# EAGLE design LDConnector v3 - CXY1 (EAGLE 7.7.0)
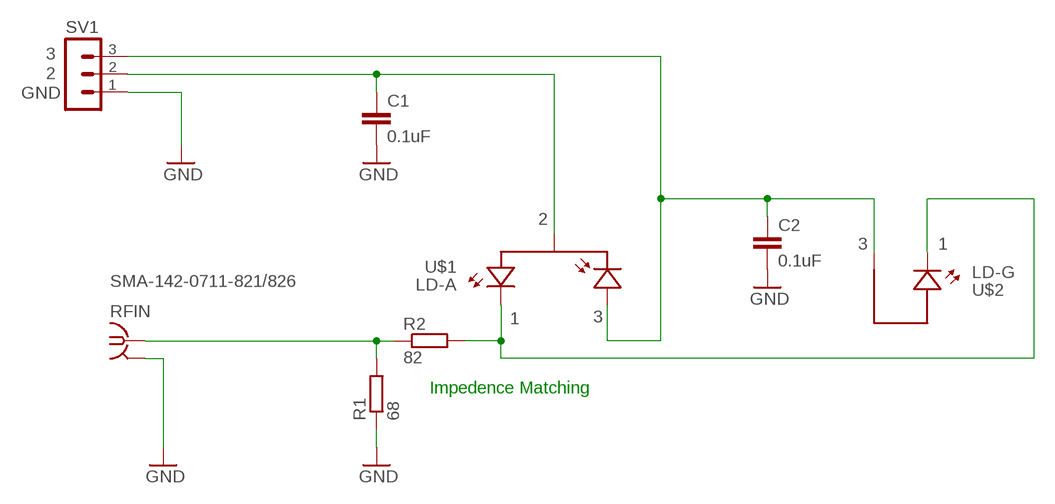
[diagram p0: schematic, sheet 1]

## Parts
C1  0.1uF  C-EUC0603  [C0603]
C2  0.1uF  C-EUC0603  [C0603]
R1  68  R-EU_R0603  [R0603]
R2  82  R-EU_R0603  [R0603]
RFIN  SMA-142-0711-821/826  [J502-ND-142-0711-821/826]
SV1  MA03-1  [MA03-1]
U$1  LD-A  [TYPEA]
U$2  LD-G  [TYPEG]

## Nets
GND: C1.2 C2.2 R1.1 RFIN.G@1 RFIN.G@2 RFIN.G@3 RFIN.G@4 SV1.1
N$1: C1.1 SV1.2 U$1.2-PDC-LDA(LDA-PDC)
N$2: R2.2 U$1.1-LDC(LDC) U$2.1-LDC(LDC)
N$3: R1.2 R2.1 RFIN.1
N$6: C2.1 SV1.3 U$1.3-PDA(PDA) U$2.3-LDA(LDA)

## Notes on the sheet
- 3
- 2
- GND
- 2
- 3 | 1
- 1 | 3
- Impedence Matching

## Library data of the parts
C1 C2 = rcl:C-EU: CAPACITOR, European symbol
R1 R2 = rcl:R-EU_: RESISTOR, European symbol
RFIN = con-coax:SMA-: SMA 50 Ohm End Launch Jack Receptacle - Round Contact Johnson Components Source: www.johnsoncomponents.com .. J502-ND.pdf; MF: JOHNSON COMPONENTS; MPN: 142-0711-821; OC_FARNELL: 1019328; OC_NEWARK: 16F3627
SV1 = con-lstb:MA03-1: PIN HEADER; OC_FARNELL: unknown; OC_NEWARK: unknown
U$1 = laser diode:LD-A
U$2 = laser diode:LD-G

## Board
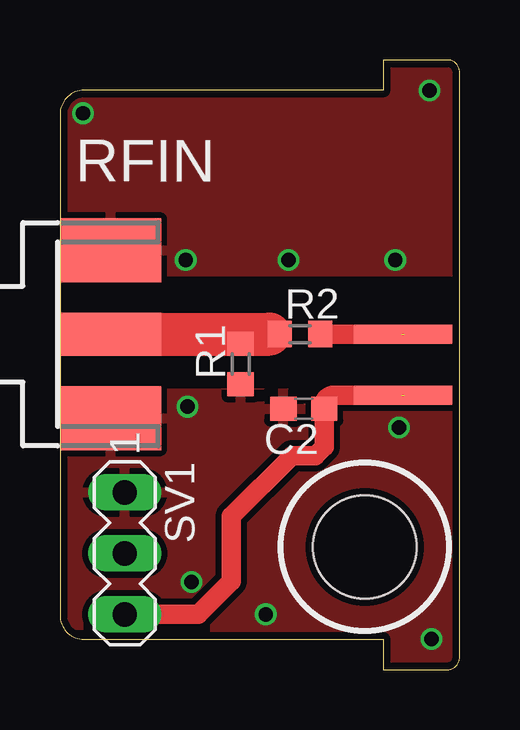
[diagram p1: board, top side]
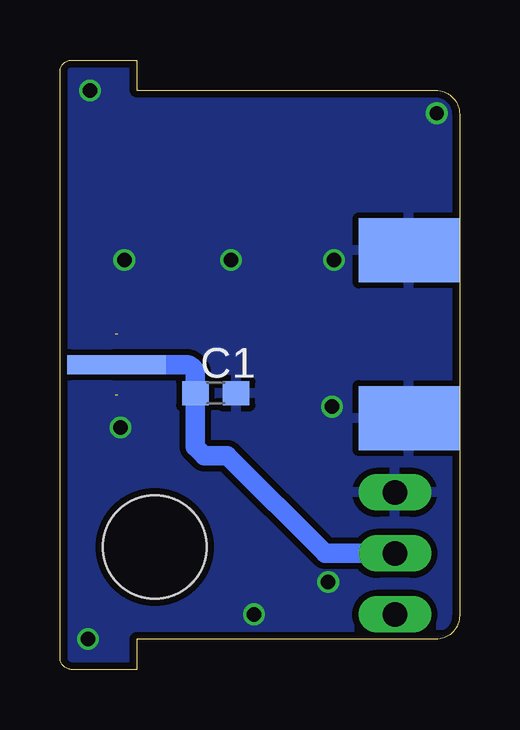
[diagram p2: board, bottom side, seen from below]

Size 16.65 x 25.4 mm. Coordinates in mm from the lower left corner, seen from the top.
Outline: 13.46,24.14 1,24.14 arc90 0,23.14 0,2.26 arc90 1,1.26 13.46,1.26 13.46,0 16.15,0 arc90 16.65,0.5 16.65,24.9 arc90 16.15,25.4 13.46,25.4 13.46,24.14
Copper layers (1*16): Top 0.035mm / dielectric 1.6mm / Bottom 0.035mm
Design rules "Elecrow_2-layer_PCB_eagle_rule *": minimum track width 6mil, minimum drill 12mil, track to track 10mil, track to pad 10mil, pad to pad 10mil, via to via 10mil, smd to smd 0mil, copper to edge 0.3mm, drill to drill 10mil, minimum pad ring 6mil, minimum via ring 6mil, stop-mask expansion 0mil, vias tented up to drill 100mil, thermal gap 10mil
Holes 4.3 mm at 12.7,5.11

### Footprints (pad centres in the part's own frame; a part is rotated, then mirrored left to right if it is on the bottom)
C0603 = smd 1.1 x 1: 1 -0.85,0; 2 0.85,0
R0603 = smd 1 x 1.1: 1 -0.85,0; 2 0.85,0
J502-ND-142-0711-821/826 = smd 4.191 x 1.778: 1 2.115,0 | smd 4.191 x 2.667: G@1 2.115,3.495; G@2 2.115,-3.495 | smd 4.191 x 2.667 bottom: G@3 2.115,3.495; G@4 2.115,-3.495
MA03-1 = drill 1.016 long: 1 -2.54,0; 2 0,0; 3 2.54,0
TYPEA = smd 4 x 0.8: 1-LDC -2.435,-1.27; 3-PDA -2.435,1.27 | smd 4 x 0.8 bottom: 2-PDC-LDA -2.435,0
TYPEG = smd 4 x 0.8: 1-LDC -2.435,1.27; 3-LDA -2.435,-1.27 | smd 4 x 0.8 bottom: 2-NC -2.435,0

### Placement (x,y rotation side)
C1  10.16,11.51 0 bottom
C2  10.16,10.88 180 top
R1  7.53,12.73 90 top
R2  10,13.98 0 top
RFIN  0,13.98 0 top
SV1  2.7,4.84 270 top
U$1  11.91,12.7 180 top
U$2  16.67,12.7 0 top

### Tracks (layer width: path | path; a pad name or v marks a point on that pad's centre or on a via)
GND  (via drill 0.6)
  other vias: 14.13,10.08 8.57,2.3 13.97,17.07 5.24,17.07 15.4,24.13 15.48,1.27 9.53,17.07 5.32,10.96 0.95,23.18 5.48,3.65
  pour Bottom: -1.27,25.64 17.78,25.64 17.78,-1.03 0,-1.03
  pour Top: 0.16,11.51 16.99,11.51 17.14,-1.03 0.16,-1.03
  pour Top: 16.51,25.64 -0.08,25.64 -0.08,16.59 16.51,16.59
N$1
  Bottom 0.813: U$1.2-PDC-LDA 11.42,12.7 arc45 11.11,12.57 arc45 11.01,12.32 C1.1 11.01,9.29 10.64,8.92 9.68,8.92 5.61,4.84 SV1.2
N$2  (1 unrouted)
  Top 0.813: U$2.1-LDC 10.93,13.97 R2.2
N$3
  Top 1.016: 6.97,14.05 RFIN.1 | R1.2 6.97,14.05 | 6.97,14.05 R2.1
N$4
  Top 1.8: 3.33,13.98 8.73,13.98
N$6  (1 unrouted)
  Top 0.813: U$2.3-LDA 11.42,11.43 arc45 11.11,11.3 arc45 11.01,11.05 C2.1 11.01,9.29 10.64,8.92 9.68,8.92 7.14,6.38 7.14,3.68 5.77,2.3 SV1.3

### Text on the board
tStop: Mitch / Cox / 2017
tDocu: LD TYPE | A: / 1 LDC / 2 COM / 3 PDA | G: / 1 LDC / 2 NC / 3 LDA | 1 | *G | 3 | GND | 2 | 3
bDocu: 2 | *A